# EAGLE design PCB_RIGID_USBC_MALE (EAGLE 9.5.2)
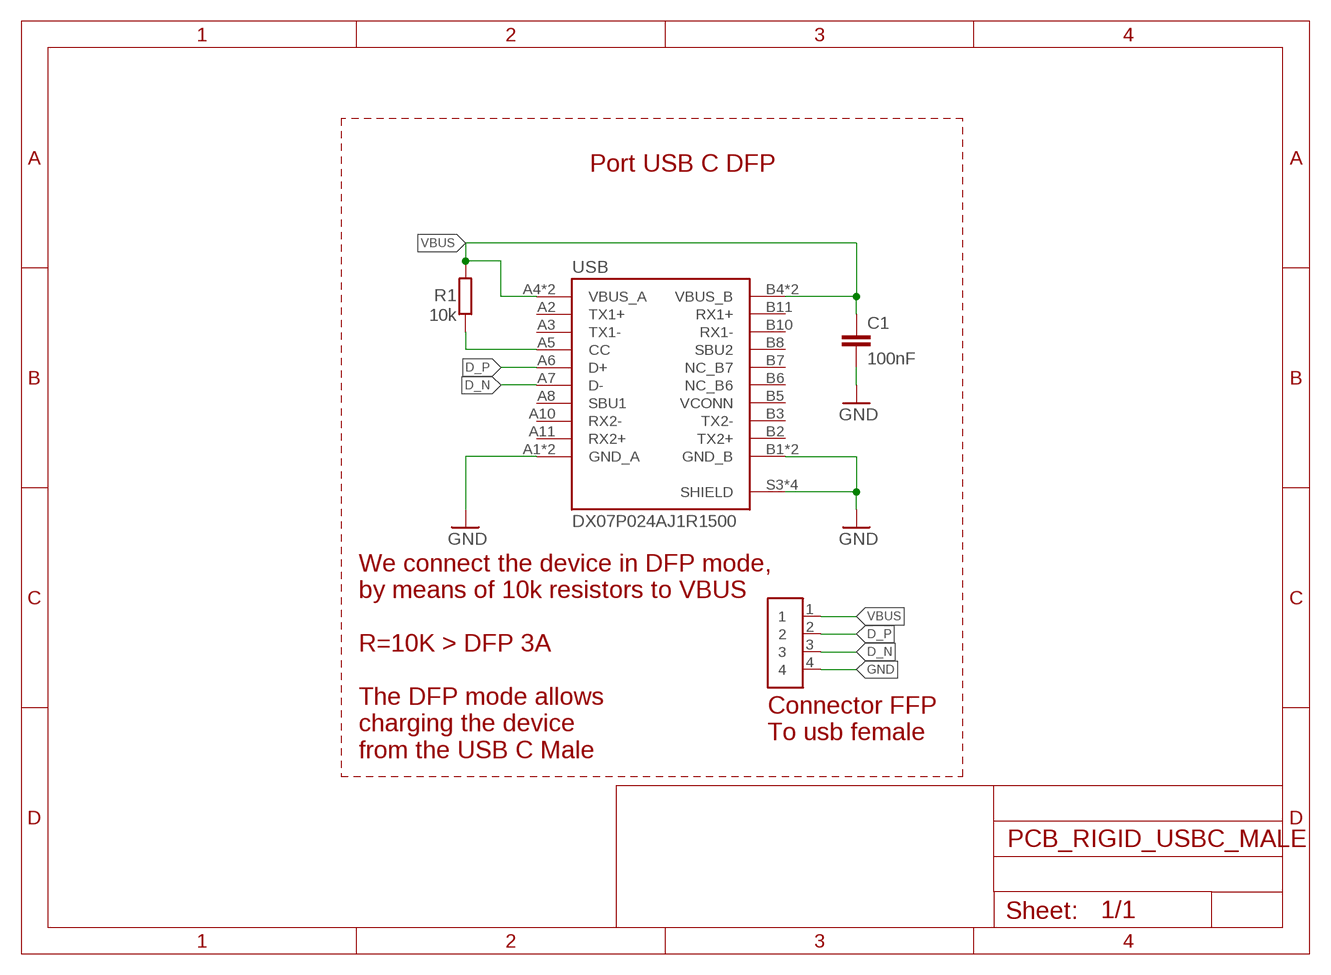
[diagram p0: schematic, sheet 1]

## Parts
C1  100nF  C_0603  [C0603]
FFP  CONN_FLEX_2.5MM  [CONN_FLEX_2.5MM]
R1  10k  R_0603  [R0603]
USB  DX07P024AJ1R1500  [JAE_DX07P024AJ1R1500]

## Nets
D_N [USB]: FFP.3 USB.A7(D-)
D_P [USB]: FFP.2 USB.A6(D+)
GND: C1.2 FFP.4 USB.A1(GND_A) USB.A12(GND_A) USB.B1(GND_B) USB.B12(GND_B) USB.S3(SHIELD) USB.S4(SHIELD) USB.S5(SHIELD) USB.S6(SHIELD)
N$1: R1.1 USB.A5(CC)
VBUS: C1.1 FFP.1 R1.2 USB.A4(VBUS_A) USB.A9(VBUS_A) USB.B4(VBUS_B) USB.B9(VBUS_B)
Unconnected: USB.A2(TX1+) USB.A3(TX1-) USB.A8(SBU1) USB.A10(RX2-) USB.A11(RX2+) USB.B2(TX2+) USB.B3(TX2-) USB.B5(VCONN) USB.B6(NC_B6) USB.B7(NC_B7) USB.B8(SBU2) USB.B10(RX1-) USB.B11(RX1+)

## Notes on the sheet
- Port USB C DFP
- We connect the device in DFP mode,
  by means of 10k resistors to VBUS
  
  R=10K > DFP 3A
- Connector FFP
  To usb female
- The DFP mode allows 
  charging the device 
  from the USB C Male

## Library data of the parts
C1 = OTG_C:C_0603: C_0603
FFP = OTG_C:CONN_FLEX_2.5MM
R1 = OTG_C:R_0603: R_0603
USB = OTG_C:DX07P024AJ1R1500: USB-C (USB TYPE-C) USB 3.2 Gen 2 (USB 3.1 Gen 2, Superspeed + (USB 3.1)) Plug Connector 24 Position Board Edge, Straddle Mount Check prices <https://pricing.snapeda.com/parts/DX07P024AJ1R1500/JAE%20Electronics/view-part?ref=eda>; AVAILABILITY: In Stock; DESCRIPTION: USB-C (USB TYPE-C) USB 3.2 Gen 2 (USB 3.1 Gen 2, Superspeed + (USB 3.1)) Plug Connector 24 Position Board Edge, Straddle Mount; MF: JAE Electronics; MP: DX07P024AJ1R1500; PACKAGE: None; PRICE: None; PURCHASE-URL: https://pricing.snapeda.com/search/part/DX07P024AJ1R1500/?ref=eda

## Net classes
1 USB: width 0.127 mm, drill 0.127 mm, clearance 0.127 mm

## Board
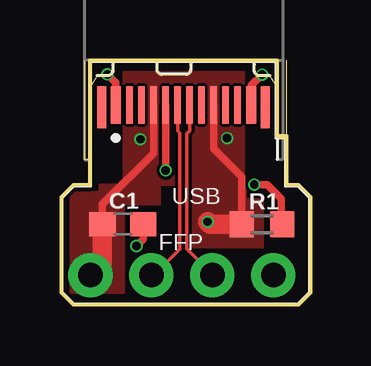
[diagram p1: board, top side]
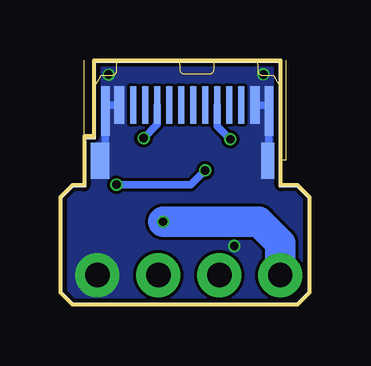
[diagram p2: board, bottom side, seen from below]

Size 10.4 x 10.2 mm. Coordinates in mm from the lower left corner, seen from the top.
Outline: 9.4,5 9.9,5 10.4,4.5 10.4,0.5 9.9,0 0.5,0 0,0.5 0,4.5 0.5,5 1.2,5 1.2,10.2 9,10.2 9,7.04 9.4,7.04 9.4,5
Copper layers (1*16): Top 0.035mm / dielectric 0.8mm / Bottom 0.035mm
Design rules "jlcpcb-2layers *": minimum track width 5mil, minimum drill 0.3mm, track to track 5mil, track to pad 5mil, pad to pad 5mil, via to via 5mil, smd to smd 5mil, copper to edge 0.2mm, drill to drill 6mil, minimum pad ring 10mil, minimum via ring 3mil, stop-mask expansion 4mil, vias tented up to drill 0mil, thermal gap 10mil

### Footprints (pad centres in the part's own frame; a part is rotated, then mirrored left to right if it is on the bottom)
C0603 = smd 1.1 x 1: 1 -0.85,0; 2 0.85,0
CONN_FLEX_2.5MM = drill 1.02: 1 0,0; 2 2.54,0; 3 5.08,0; 4 7.62,0
R0603 = smd 1 x 1.1: 1 -0.85,0; 2 0.85,0
JAE_DX07P024AJ1R1500 = smd 0.41 x 1.55: A1 2.825,1.875; A12 -2.825,1.875 | smd 0.26 x 1.55: A2 2.25,1.875; A3 1.75,1.875; A4 1.25,1.875; A5 0.75,1.875; A6 0.25,1.875; A7 -0.25,1.875; A8 -0.75,1.875; A9 -1.25,1.875; A10 -1.75,1.875; A11 -2.25,1.875 | smd 0.41 x 1.55 bottom: B1 -2.825,1.875; B12 2.825,1.875 | smd 0.26 x 1.55 bottom: B2 -2.25,1.875; B3 -1.75,1.875; B4 -1.25,1.875; B5 -0.75,1.875; B6 -0.25,1.875; B7 0.25,1.875; B8 0.75,1.875; B9 1.25,1.875; B10 1.75,1.875; B11 2.25,1.875 | smd 0.36 x 1.75: S1 -3.405,1.975; S2 3.405,1.975 | smd 0.36 x 2.05 bottom: S3 -3.405,2.125; S4 3.405,2.125 | smd 0.785 x 1.5 bottom: S5 -3.632,4.2 | smd 0.55 x 1.5 bottom: S6 3.35,4.2

### Placement (x,y rotation side)
C1  2.57,3.36 0 top
FFP  1.22,1.24 0 top
R1  8.37,3.36 180 top
USB  5.1,10.2 180 top

### Tracks (layer width: path | path; a pad name or v marks a point on that pad's centre or on a via)
D_N
  Top 0.152: USB.A7 5.35,7.24 5.24,7.13 5.24,2.33 6.3,1.28 6.28,1.26 FFP.3
D_P
  Top 0.152: USB.A6 4.85,7.24 4.94,7.15 4.94,2.32 3.86,1.24 FFP.2
GND  (via drill 0.35)
  Top 0.305: USB.A1 2.28,9.25 v1.93,9.6 | USB.A12 7.93,9.14 v8.37,9.59 | C1.2 3.42,2.73 v3.14,2.45
  Bottom 0.305: USB.S5 8.51,6.23 USB.S3 8.51,8.27 8.46,8.32 USB.A12 | USB.S6 1.7,6.05 USB.S4 1.7,8.32 USB.A1
  pour Bottom (no thermals): 1.2,5 0.5,5 0,4.5 0,0.47 0.47,0 9.9,0 10.4,0.5 10.4,4.5 9.9,5 9.4,5 9.4,7.1 9,7.1 9,10.2 1.2,10.2
N$1  (via drill 0.35)
  Top 0.305: USB.A5 v4.35,5.6 | v8.05,5.01 8.6,5.01 9.18,4.43 9.18,3.4 R1.1
  Bottom 0.305: v4.35,5.6 4.94,5.01 v8.05,5.01
VBUS  (via drill 0.35)
  Top 0.305: USB.B9 3.85,6.32 1.72,4.19 C1.1 | USB.B4 6.35,6.5 7.52,5.33 R1.2
  Top 0.813: C1.1 1.72,1.73 FFP.1 | R1.2 6.21,3.36 v6.1,3.46
  Bottom 0.305: USB.B9 3.85,7.45 v3.3,6.9 | USB.B4 6.35,7.52 v6.92,6.95
  Bottom 1.27: FFP.1 1.22,2.56 2.12,3.46 v6.1,3.46
  pour Top (no thermals): 2.6,9.7 2.6,5 7.6,5 7.6,9.7
  pour Top (no thermals): 5.5,5 5.5,2.4 8.4,2.4 8.4,4.4 7.7,4.4 7.7,5
  pour Top (no thermals): 0.4,4.7 0.4,0.5 2.6,0.5 2.6,4.2 4.1,4.2 4.1,5 1.6,5 1.6,4.7